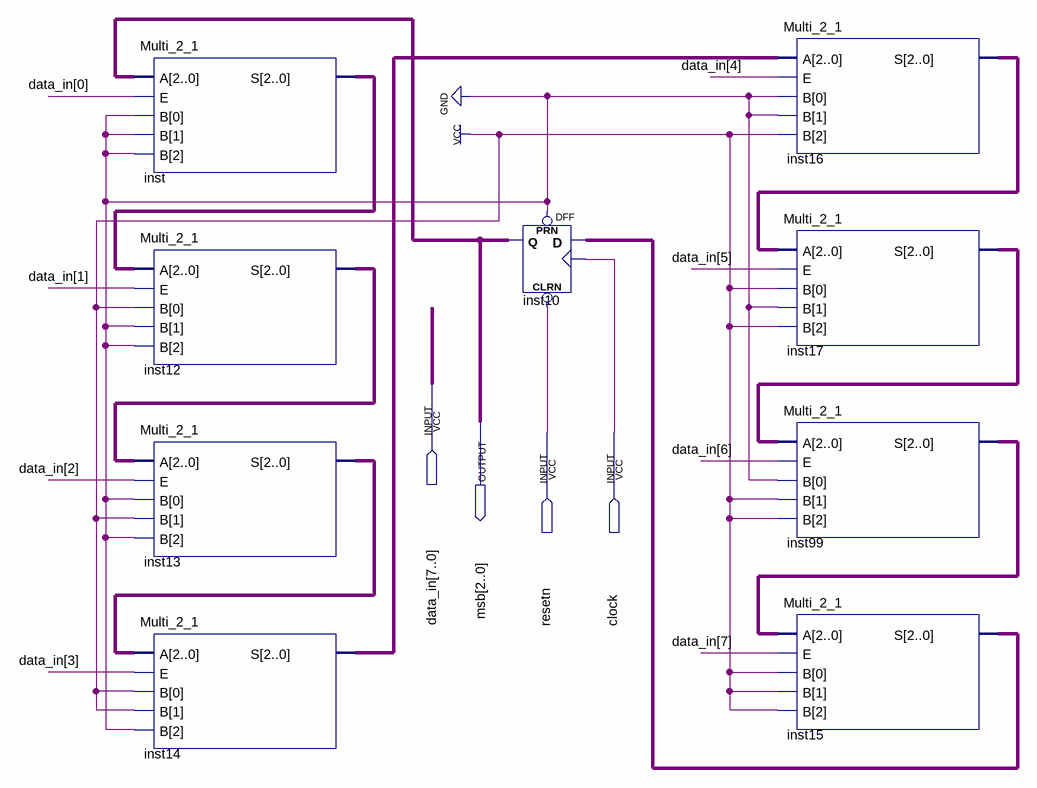
[diagram p0: schematic sheet]
// Quartus schematic Questao05.bdf as structural Verilog: 9 symbols, 4 pins
module Questao05 (
  input  [7:0] data_in,
  input  resetn,
  input  clock,
  output [2:0] msb
);

  wire [2:0] inst12_s, inst13_s, inst14_s, inst15_s, inst16_s, inst17_s, inst99_s, inst_s;

  Multi_2_1 inst (.A(msb), .E(data_in[0]), .B(3'b000), .S(inst_s));
  Multi_2_1 inst12 (.A(inst_s), .E(data_in[1]), .B(3'b001), .S(inst12_s));
  Multi_2_1 inst13 (.A(inst12_s), .E(data_in[2]), .B(3'b010), .S(inst13_s));
  Multi_2_1 inst14 (.A(inst13_s), .E(data_in[3]), .B(3'b011), .S(inst14_s));
  DFF inst10[2:0] (.CLRN(resetn), .CLK(clock), .D(inst15_s), .PRN(1'b0), .Q(msb));
  Multi_2_1 inst16 (.A(inst14_s), .E(data_in[4]), .B(3'b100), .S(inst16_s));
  Multi_2_1 inst17 (.A(inst16_s), .E(data_in[5]), .B(3'b101), .S(inst17_s));
  Multi_2_1 inst99 (.A(inst17_s), .E(data_in[6]), .B(3'b110), .S(inst99_s));
  Multi_2_1 inst15 (.A(inst99_s), .E(data_in[7]), .B(3'b111), .S(inst15_s));
endmodule
